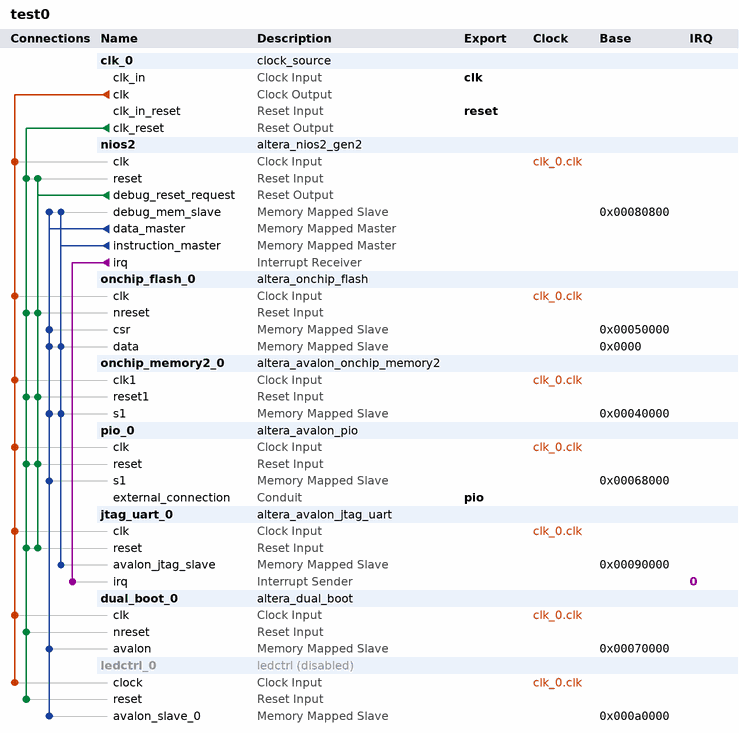
[diagram p0: system contents]
# Platform Designer (Qsys) system test0, MAX 10 10M08DAF484C8GES
# Parameters at their usual value, and those the tool derives, are not listed.
package require -exact qsys 14.1
create_system test0
set_project_property DEVICE_FAMILY {MAX 10}
set_project_property DEVICE 10M08DAF484C8GES

add_instance clk_0 clock_source 14.1
set_instance_parameter_value clk_0 clockFrequency 50000000

add_instance nios2 altera_nios2_gen2 14.1
set_instance_parameter_value nios2 dcache_size 2048
set_instance_parameter_value nios2 exceptionSlave onchip_memory2_0.s1
set_instance_parameter_value nios2 icache_size 4096
set_instance_parameter_value nios2 impl Tiny
set_instance_parameter_value nios2 resetSlave onchip_flash_0.data

add_instance onchip_flash_0 altera_onchip_flash 14.1.1
set_instance_parameter_value onchip_flash_0 CONFIGURATION_MODE {Dual Compressed Images}
set_instance_parameter_value onchip_flash_0 SECTOR_ACCESS_MODE {Read and write,Read and write,Read and write,Read and write,Hidden}
set_instance_parameter_value onchip_flash_0 initFlashContent false
set_instance_parameter_value onchip_flash_0 initializationFileName altera_onchip_flash.hex
set_instance_parameter_value onchip_flash_0 useNonDefaultInitFile false

add_instance onchip_memory2_0 altera_avalon_onchip_memory2 14.1
set_instance_parameter_value onchip_memory2_0 dataWidth 32
set_instance_parameter_value onchip_memory2_0 dualPort false
set_instance_parameter_value onchip_memory2_0 initMemContent false
set_instance_parameter_value onchip_memory2_0 initializationFileName onchip_mem.hex
set_instance_parameter_value onchip_memory2_0 memorySize 4096

add_instance pio_0 altera_avalon_pio 14.1
set_instance_parameter_value pio_0 direction Output
set_instance_parameter_value pio_0 width 8

add_instance jtag_uart_0 altera_avalon_jtag_uart 14.1
set_instance_parameter_value jtag_uart_0 simInteractiveOptions NO_INTERACTIVE_WINDOWS

add_instance dual_boot_0 altera_dual_boot 14.1
set_instance_parameter_value dual_boot_0 CLOCK_FREQUENCY 50.0

add_instance ledctrl_0 ledctrl 1.0
set_instance_property ledctrl_0 ENABLED false

# connections
add_connection clk_0.clk dual_boot_0.clk clock
add_connection clk_0.clk jtag_uart_0.clk clock
add_connection clk_0.clk ledctrl_0.clock clock
add_connection clk_0.clk nios2.clk clock
add_connection clk_0.clk onchip_flash_0.clk clock
add_connection clk_0.clk onchip_memory2_0.clk1 clock
add_connection clk_0.clk pio_0.clk clock
add_connection clk_0.clk_reset dual_boot_0.nreset reset
add_connection clk_0.clk_reset jtag_uart_0.reset reset
add_connection clk_0.clk_reset ledctrl_0.reset reset
add_connection clk_0.clk_reset nios2.reset reset
add_connection clk_0.clk_reset onchip_flash_0.nreset reset
add_connection clk_0.clk_reset onchip_memory2_0.reset1 reset
add_connection clk_0.clk_reset pio_0.reset reset
add_connection nios2.debug_reset_request jtag_uart_0.reset reset
add_connection nios2.debug_reset_request nios2.reset reset
add_connection nios2.debug_reset_request onchip_flash_0.nreset reset
add_connection nios2.debug_reset_request onchip_memory2_0.reset1 reset
add_connection nios2.debug_reset_request pio_0.reset reset
add_connection nios2.data_master dual_boot_0.avalon avalon
set_connection_parameter_value nios2.data_master/dual_boot_0.avalon baseAddress 0x00070000
add_connection nios2.data_master ledctrl_0.avalon_slave_0 avalon
set_connection_parameter_value nios2.data_master/ledctrl_0.avalon_slave_0 baseAddress 0x000a0000
add_connection nios2.data_master nios2.debug_mem_slave avalon
set_connection_parameter_value nios2.data_master/nios2.debug_mem_slave baseAddress 0x00080800
add_connection nios2.data_master onchip_flash_0.csr avalon
set_connection_parameter_value nios2.data_master/onchip_flash_0.csr baseAddress 0x00050000
add_connection nios2.data_master onchip_flash_0.data avalon
set_connection_parameter_value nios2.data_master/onchip_flash_0.data baseAddress 0x0000
add_connection nios2.data_master onchip_memory2_0.s1 avalon
set_connection_parameter_value nios2.data_master/onchip_memory2_0.s1 baseAddress 0x00040000
add_connection nios2.data_master pio_0.s1 avalon
set_connection_parameter_value nios2.data_master/pio_0.s1 baseAddress 0x00068000
add_connection nios2.instruction_master jtag_uart_0.avalon_jtag_slave avalon
set_connection_parameter_value nios2.instruction_master/jtag_uart_0.avalon_jtag_slave baseAddress 0x00090000
add_connection nios2.instruction_master nios2.debug_mem_slave avalon
set_connection_parameter_value nios2.instruction_master/nios2.debug_mem_slave baseAddress 0x00080800
add_connection nios2.instruction_master onchip_flash_0.data avalon
set_connection_parameter_value nios2.instruction_master/onchip_flash_0.data baseAddress 0x0000
add_connection nios2.instruction_master onchip_memory2_0.s1 avalon
set_connection_parameter_value nios2.instruction_master/onchip_memory2_0.s1 baseAddress 0x00040000
add_connection nios2.irq jtag_uart_0.irq interrupt
set_connection_parameter_value nios2.irq/jtag_uart_0.irq irqNumber 0

# exported interfaces
add_interface clk clock sink
set_interface_property clk EXPORT_OF clk_0.clk_in
add_interface pio conduit end
set_interface_property pio EXPORT_OF pio_0.external_connection
add_interface reset reset sink
set_interface_property reset EXPORT_OF clk_0.clk_in_reset

set_interconnect_requirement {$system} qsys_mm.clockCrossingAdapter HANDSHAKE
set_interconnect_requirement {$system} qsys_mm.insertDefaultSlave FALSE
set_interconnect_requirement {$system} qsys_mm.maxAdditionalLatency 1

save_system test0.qsys
